# Altium schematic sheet PCB_Project_1TOP.SchDoc
size 431 x 279 mm; ENG_APP_DATE: --/--/--; DSN_APP_DATE: --/--/--; CHK_APP_DATE: --/--/--
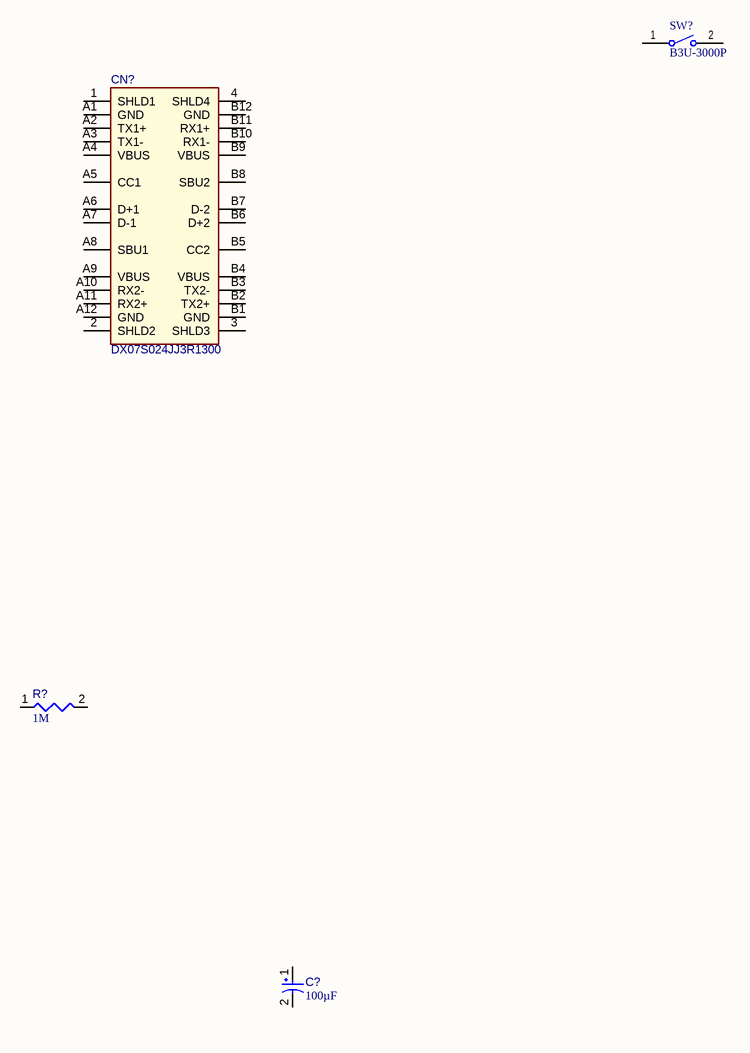
[diagram p0: PCB_Project_1TOP.SchDoc]

## Parts
C?  value 100µF  [AVX-TAJ-C-2_M]  (hidden comment: TAJC107K010RNJ)
CN?  DX07S024JJ3R1300  [JAE-DX07S024JJ3_V]
R?  value 1M  [RESA60-630X240]  (hidden comment: MFR-25FBF52-1M)
SW?  B3U-3000P  [OMRON-B3U-3000P_V]

## Nets

Not connected (* = marked no-connect by the designer): C? 1 2; CN? 1(SHLD1) 2(SHLD2) 3(SHLD3) 4(SHLD4) A1(GND) A2(TX1+) A3(TX1-) A4(VBUS) A5(CC1) A6(D+1) A7(D-1) A8(SBU1) A9(VBUS) A10(RX2-) A11(RX2+) A12(GND) B1(GND) B2(TX2+) B3(TX2-) B4(VBUS) B5(CC2) B6(D+2) B7(D-2) B8(SBU2) B9(VBUS) B10(RX1-) B11(RX1+) B12(GND); R? 1 2; SW? 1 2

## Notes on the sheet
- 8
- 7
- 6
- 5
- 4
- 3
- DWG. NO.
- REV.
- SHT.
- 2
- 1
- THIS DOCUMENT AND THE DATA DISCLOSED HEREIN OR HEREWITH IS THE PROPERTY OF ALTIUM LIMITED AND MAY BE FREELY DISTRIBUTED IN WHOLE. NO RIGHTS ARE RESERVED OR EXPRESS OR IMPLIED WARANTEE GIVEN.
- REVISION
- DESCRIPTION
- DATE
- APPROVED
- F
- E
- D
- C
- B
- A
- TITLE
- SCALE:
- SIZE
- CAGE CODE
- FILE NAME
- DWG NO.
- SHEET
- OF
- REV

## Library data of the parts
C? = CMP-001-00045-5: Standard Tantalum, 100 uF, +/- 10%, 10 V, -55 to 125 degC, 2312 (6032 Metric), RoHS, Tape and Reel; Manufacturer: AVX; Voltage Rating: 10V; ESR: 1.2Ohm; Package Description: 2-Pin Surface Mount Device, Body 6 x 3.25 mm; Max Operating Temperature: 125°C; Case/Package: 2412; Datasheet URL: http://datasheets.avx.com/TAJ.pdf; Min Operating Temperature: -55°C; Package Reference: TAJ-C-2; Capacitor Type: Tantalum; Tolerance: 10%; Pins: 2; Package Quantity: 500; Packaging: TapeandReel; Mounting Technology: SM; RoHS Compliant: True; Manufacturer URL: http://www.avx.com/; Datasheet Version: Feb-16
CN? = CMP-002-00065-1: USB-C Connector, 20 V, 1.25 A, -30 to 80 degC, RoHS, Tape and Reel; Gender: Receptacle; Connector Type: USB-C; Pins: 28
R? = CMP-009-00049-3: Axial Resistor, 1 MOhm, +/- 1%, 250 mW, -55 to 155 degC, 2-Pin THD, RoHS, Bulk; Manufacturer: Yageo; Voltage Rating: 250V; Power: 250mW; Case/Package: Axial; Tolerance: 1%; Manufacturer URL: http://www.yageo.com/; Max Operating Temperature: 155°C; Datasheet URL: http://www.yageo.com/documents/recent/Yageo%20LR_MFR_2013.pdf; Package Description: 2-Pin Axial Lead, Dia 2.4 mm, Body Length 6.3 mm; Package Quantity: 200; Mounting Technology: TH; RoHS Compliant: True; Datasheet Version: Apr-13; Min Operating Temperature: -55°C; Packaging: Bulk; Package Reference: MFR-25
SW? = CMP-011-00005-1: Tactile Switch, SPST-NO, 0.05 A, 12 V, -25 to 70 degC, 2-Pin SMD, RoHS, Tape and Reel; Manufacturer: Omron Electronic Components; Contact Current Rating: 50mA; IP Rating: IP40; Operating Force: 162gf; Max Voltage Rating (DC): 12V; Max Contact Resistance: 100mohm; Throw Configuration: SPST; RoHS Compliant: True; Package Reference: B3U-3000P; Contact Material: Silver; Package Quantity: 4000; Package Description: 2-Pin Surface Mount Device, Body 4 x 3.2 mm; Manufacturer URL: http://www.omron.com/; Min Operating Temperature: -25°C; Max Operating Temperature: 70°C; Datasheet URL: https://www.omron.com/ecb/products/pdf/en-b3u.pdf; Mounting Technology: SM; Case/Package: B3U-3000P; Packaging: TapeandReel; Max Current Rating: 50mA; Current Rating: 50mA; Datasheet Version: Jan-15; Voltage Rating: 12V; Voltage Rating (DC): 12V